# EAGLE design USBcircuit (EAGLE 7.1.0)
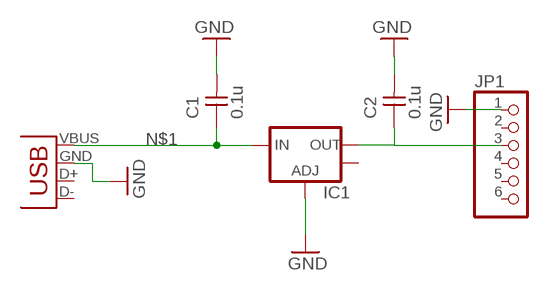
[diagram p0: schematic, sheet 1]

## Parts
C1  0.1u  1608  [1608]
C2  0.1u  1608  [1608]
IC1  V_REG_LM1117SOT223  [SOT223]
JP1  PINHD-1X6NORMAL  [1X06]
JP3  USB-A-H  [USB-A-H]

## Nets
GND: C1.P$2 C2.P$2 IC1.1(ADJ) JP1.1 JP3.GND(VBUS)
N$1: C1.P$1 IC1.3(IN) JP3.VBUS(GND)
N$2: C2.P$1 IC1.2(OUT) JP1.3
Unconnected: IC1.4(OUT) JP1.2 JP1.4 JP1.5 JP1.6 JP3.D+(D-) JP3.D-(D+)

## Library data of the parts
C1 C2 = 01_capacitor:1608
IC1 = SparkFun-PowerIC:V_REG_LM1117: Voltage Regulator LM1117 Standard adjustable voltage regulator but in SMD form. Spark Fun Electronics SKU : COM-00595
JP1 = 09_con-pin:PINHD-1X6: PIN HEADER
JP3 = SparkFun-Connectors:USB: USB Connectors USB-B-PTH is fully proven SKU : PRT-00139/CONN-08278 USB-miniB is fully proven SKU : PRT-00587 USB-A-PCB is untested. USB-A-H is throughly reviewed, but untested. Spark Fun Electronics SKU : PRT-00437 USB-B-SMT is throughly reviewed, but untested. Needs silkscreen touching up. USB-A-S has not been used/tested USB-MB-H has not been used/tested USB-MICROB has been used. CONN-09505

## Board
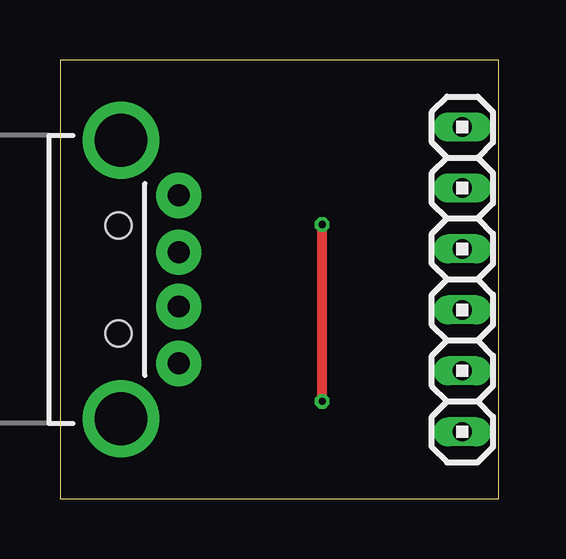
[diagram p1: board, top side]
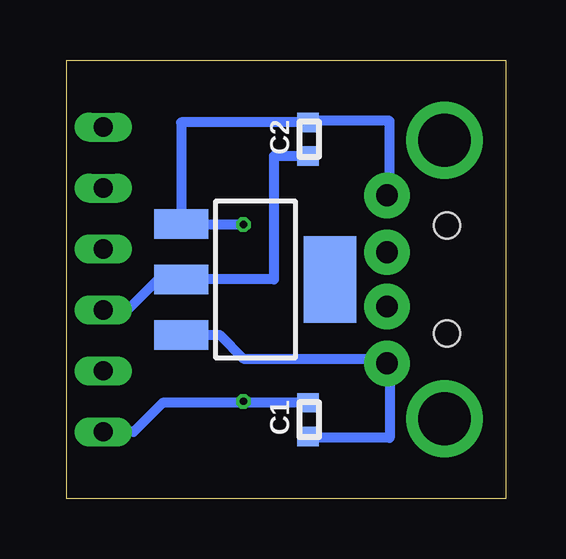
[diagram p2: board, bottom side, seen from below]

Size 18.29 x 18.29 mm. Coordinates in mm from the lower left corner, seen from the top.
Outline: 0,0 18.29,0 18.29,18.29 0,18.29 0,0
Copper layers (1*16): Top 0.035mm / dielectric 1.53mm / Bottom 0.035mm
Design rules "pban_5mil-l2": minimum track width 5mil, minimum drill 0.3mm, track to track 5mil, track to pad 0.229mm, pad to pad 5mil, via to via 5mil, smd to smd 5mil, copper to edge 0.5mm, drill to drill 0.5mm, minimum pad ring 0.15mm, minimum via ring 0.15mm, stop-mask expansion 4mil, vias tented up to drill 0.35mm, thermal gap 10mil

### Footprints (pad centres in the part's own frame; a part is rotated, then mirrored left to right if it is on the bottom)
1608 = smd 0.8 x 0.9: P$1 -0.7,0.1; P$2 0.7,0.1
SOT223 = smd 1.219 x 2.235: 1 -2.311,-3.099; 2 0,-3.099; 3 2.311,-3.099 | smd 3.6 x 2.2: 4 0,3.099
1X06 = drill 0.8 long: 1 -6.35,0; 2 -3.81,0; 3 -1.27,0; 4 1.27,0; 5 3.81,0; 6 6.35,0
USB-A-H = drill 0.914 pad 1.88: D+ 2.4,1.127; D- 2.4,-1.127; GND 2.4,3.5; VBUS 2.4,-3.5 | drill 2.2: GND2 0,-5.8; GND3 0,5.8 | hole 1.1: -0.1,2.25; -0.1,-2.25

### Placement (x,y rotation side)
C1  8.13,3.3 90 bottom
C2  8.13,14.99 90 bottom
IC1  10.41,9.14 270 bottom
JP1  16.76,9.14 90 top
JP3  2.54,9.14 0 top

### Tracks (layer width: path | path; a pad name or v marks a point on that pad's centre or on a via)
GND  (via drill 0.3)
  Top 0.406: v10.92,4.06 v10.92,11.43
  Bottom 0.406: JP3.GND 4.83,12.64 4.83,15.75 8.23,15.75 C2.P$2 13.51,15.69 IC1.1 13.51,11.43 v10.92,11.43 | v10.92,4.06 10.92,4 C1.P$2 14.29,4 15.49,2.79 JP1.1
N$1
  Bottom 0.406: C1.P$1 8.23,2.54 4.83,2.54 4.83,5.64 JP3.VBUS 5.14,5.84 10.92,5.84 11.91,6.83 IC1.3
N$2
  Bottom 0.406: C2.P$1 9.65,14.29 9.65,9.14 IC1.2 14.48,9.14 15.75,7.87 JP1.3